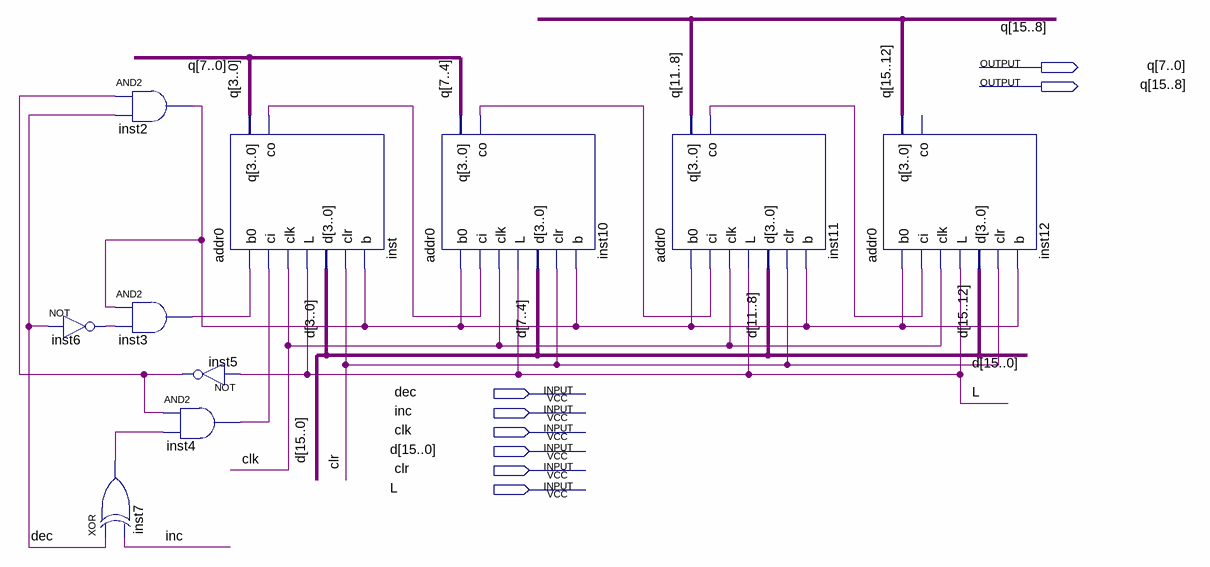
[diagram p0: schematic sheet]
// Quartus schematic addrz.bdf as structural Verilog: 10 symbols, 8 pins
module addrz (
  input  dec,
  input  inc,
  input  clk,
  input  [15:0] d,
  input  clr,
  input  L,
  output [15:0] q
);

  wire inst2_out, inst3_out, inst4_out, inst5_out, inst6_out, inst7_out, inst10_co, inst11_co, inst_co;

  not inst6 (inst6_out, dec);
  and inst2 (inst2_out, inst5_out, dec);
  and inst3 (inst3_out, inst2_out, inst6_out);
  xor inst7 (inst7_out, dec, inc);
  addr0 inst (
    .b0(inst3_out), .ci(inst4_out), .clk(clk), .L(L), .d(d[3:0]), .clr(clr), .b(inst2_out), .q(q[3:0]),
    .co(inst_co));
  not inst5 (inst5_out, L);
  and inst4 (inst4_out, inst5_out, inst7_out);
  addr0 inst10 (
    .b0(inst2_out), .ci(inst_co), .clk(clk), .L(L), .d(d[7:4]), .clr(clr), .b(inst2_out), .q(q[7:4]),
    .co(inst10_co));
  addr0 inst11 (
    .b0(inst2_out), .ci(inst10_co), .clk(clk), .L(L), .d(d[11:8]), .clr(clr), .b(inst2_out), .q(q[11:8]),
    .co(inst11_co));
  addr0 inst12 (
    .b0(inst2_out), .ci(inst11_co), .clk(clk), .L(L), .d(d[15:12]), .clr(clr), .b(inst2_out), .q(q[15:12]));  // open: co
endmodule
